# Altium schematic sheet Power.SchDoc
size A3; Organization: Altium Limited; Address1: L3, 12a Rodborough Rd; Address2: Frenchs Forest; Address3: NSW; Address4: Australia 2086
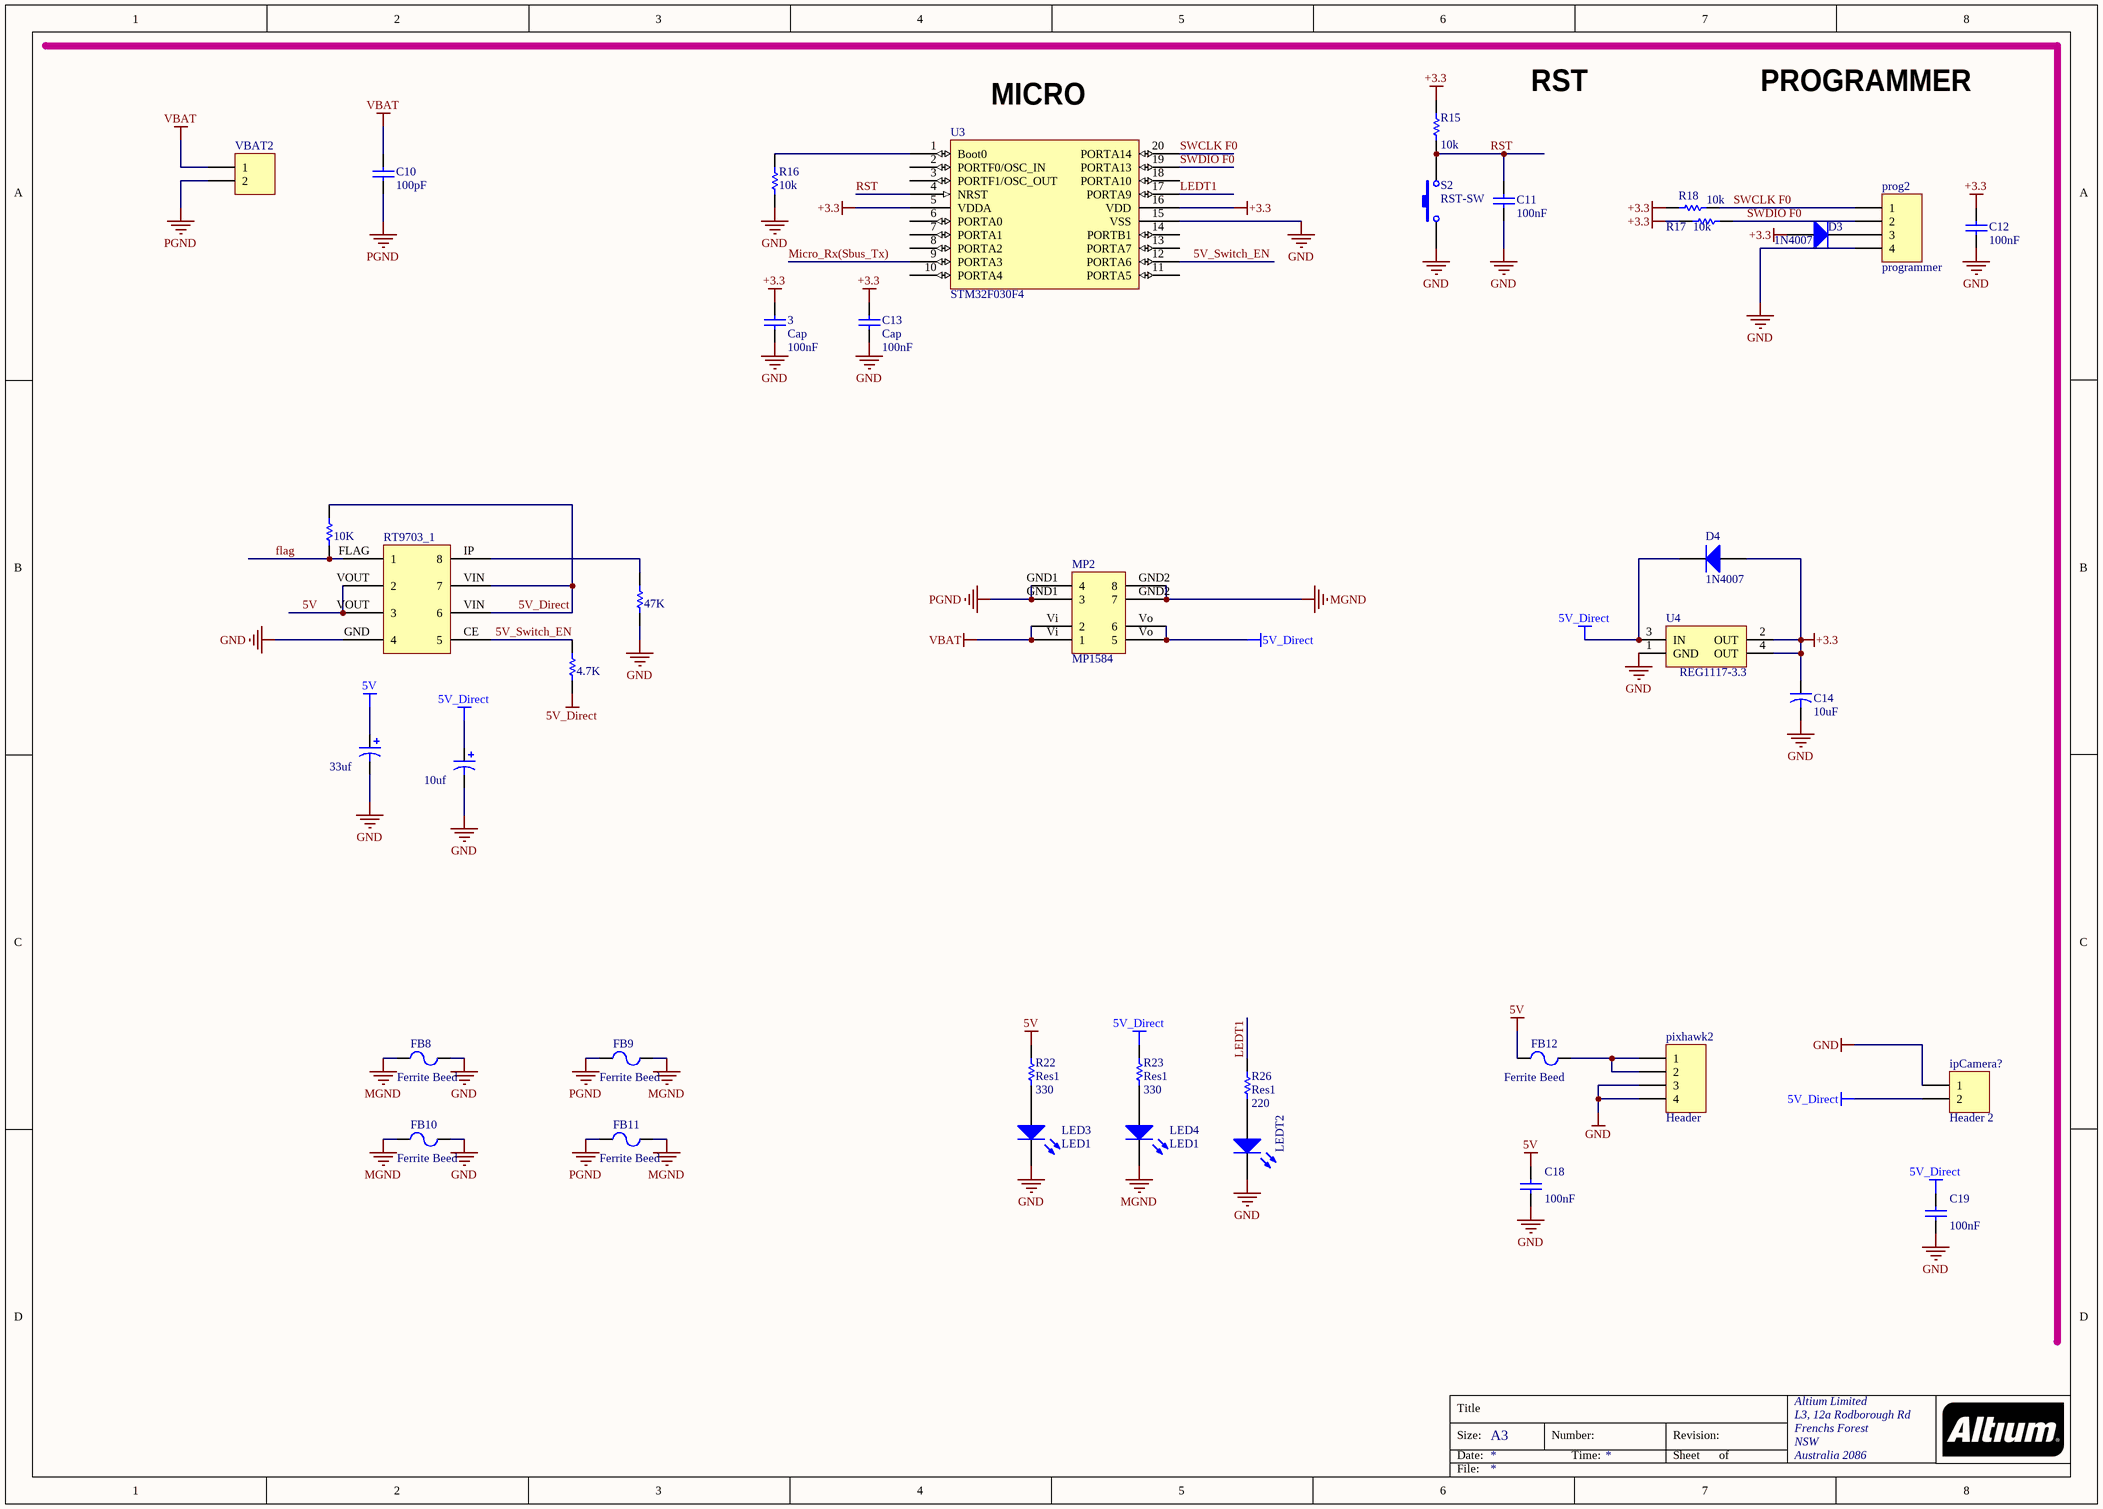
[diagram p0: Power.SchDoc]

## Parts
3  Cap  value 100nF  [j1-0603]
C10  value 100pF  [Deep Cap gerdaloo]  (hidden comment: Cap_UP)
C11  value 100nF  [j1-0603]
C12  value 100nF  [j1-0603]
C13  Cap  value 100nF  [j1-0603]
C14  value 10uF  [J1-0603]  (hidden comment: Cap_El)
C15  value 33uf  [J1-0603]  (hidden comment: Cap Pol1)
C16  value 10uf  [J1-0603]  (hidden comment: Cap Pol1)
C18  value 100nF  [j1-0603]
C19  value 100nF  [j1-0603]
D3  1N4007  [US1M]
D4  1N4007  [US1M]
FB8  Ferrite Beed  [deepFB]
FB9  Ferrite Beed  [deepFB]
FB10  Ferrite Beed  [deepFB]
FB11  Ferrite Beed  [deepFB]
FB12  Ferrite Beed  [6-0805_L]
ipCamera?  Header 2  [HDR1X2]
LED3  LED1  [3518]
LED4  LED1  [3518]
LEDT2  (no value)  [3518]
MP2  MP1584  [MP1584]
pixhawk2  Header  [SHeader 4]
prog2  programmer  [SHeader 4]
R15  value 10k  [J1-0603]
R16  10k  [j1-0603]
R17  value 10k  [J1-0603]
R18  value 10k  [J1-0603]
R19  value 10K  [j1-0603]  (hidden comment: Res1)
R20  value 47K  [j1-0603]  (hidden comment: Res1)
R21  value 4.7K  [j1-0603]  (hidden comment: Res1)
R22  Res1  value 330  [j1-0603]
R23  Res1  value 330  [j1-0603]
R26  Res1  value 220  [j1-0603]
RT9703_1  RT9703( 3A power switch)  [RT9703]  (value not drawn)
S2  RST-SW  [SW-PB-4P]
U3  STM32F030F4  [STM-TSSOP20_L]
U4  REG1117-3.3  [SOT223]
VBAT2  Header 2  [xt-30]  (value not drawn)

## Nets
5V: C15.1 C18.2 FB12.1 R22.1 RT9703_1.VOUT(2)
5V_Direct: C16.1 C19.2 D4.2(K) ipCamera?.2 MP2.Vo(5) R19.1 R21.2 R23.1 RT9703_1.VIN(7) U4.3(IN)
+3.3: 3.2 C12.2 C13.2 C14.1 D3.1(A) D4.1(A) R15.1 R17.1 R18.1 U3.5(VDDA) U3.16(VDD) U4.2(OUT) U4.4(OUT)
GND: 3.1 C11.1 C12.1 C13.1 C14.2 C15.2 C16.2 C18.1 C19.1 FB8.2 FB10.2 ipCamera?.1 LED3.2(K) LEDT2.2(K) pixhawk2.3 pixhawk2.4 prog2.4 R16.1 R20.1 RT9703_1.GND(4) S2.1 U3.15(VSS) U4.1(GND)
MGND: FB8.1 FB9.2 FB10.1 FB11.2 LED4.2(K) MP2.GND2(8)
PGND: C10.1 FB9.1 FB11.1 MP2.GND1(4) VBAT2.-(2)
VBAT: C10.2 MP2.Vi(1) VBAT2.+(1)
5V_Switch_EN: R21.1 RT9703_1.CE(5) U3.12(PORTA6)
flag: R19.2 RT9703_1.FLAG(1)
LEDT1: R26.1 U3.17(PORTA9)
Micro_Rx(Sbus_Tx): U3.9(PORTA3)
RST: C11.2 R15.2 S2.2 U3.4(NRST)
SWCLK F0: prog2.1 R18.2 U3.20(PORTA14)
SWDIO F0: prog2.2 R17.2 U3.19(PORTA13)
NetD3_2: D3.2(K) prog2.3
NetFB12_2: FB12.2 pixhawk2.1 pixhawk2.2
NetLED3_1: LED3.1(A) R22.2
NetLED4_1: LED4.1(A) R23.2
NetLEDT2_1: LEDT2.1(A) R26.2
NetR16_2: R16.2 U3.1(Boot0)
NetR20_2: R20.2 RT9703_1.IP(8)

Not connected (* = marked no-connect by the designer): U3 2(PORTF0/OSC_IN) 3(PORTF1/OSC_OUT) 6(PORTA0) 7(PORTA1) 8(PORTA2) 10(PORTA4) 11(PORTA5) 13(PORTA7) 14(PORTB1) 18(PORTA10)

## Notes on the sheet
- (near U3) MICRO
- RST
- PROGRAMMER
- Title
- Size:
- Date:
- A3
- Number:
- Time:
- Revision:
- Sheet
- of
- File:

## Library data of the parts
3 C13 = Cap: Capacitor; Published: 8-Jun-2000; LatestRevisionDate: 17-Jul-2002; LatestRevisionNote: Re-released for DXP Platform.; PackageReference: RAD-0.3; Publisher: Altium Limited
C10 = Cap_UP: Capacitor; Published: 8-Jun-2000; LatestRevisionDate: 17-Jul-2002; LatestRevisionNote: Re-released for DXP Platform.; PackageReference: RAD-0.3; Publisher: Altium Limited
C11 C12 C18 C19 = Cap: Capacitor; Manufacturer: Generic Components; Class: Passive; Published: 08/06/2000; Publisher: Altium Hobart Technology Centre; SubClass: Capacitor
C14 = Cap_El: Capacitor; Published: 23-Sep-2002; PackageReference: CAPR5-4X5; Publisher: Altium Limited
C15 C16 = Cap Pol1: Polarized Capacitor (Radial); Published: 8-Jun-2000; LatestRevisionDate: 17-Jul-2002; LatestRevisionNote: Re-released for DXP Platform.; PackageReference: RB7.6-15; Publisher: Altium Limited
D3 D4 = Diode: 1 Amp General Purpose Rectifier; Revision 1: 11-Jul-2000: SIM Model Added.; Revision 2: 17-Jul-2002: Re-released for DXP Platform.; Package Information: Latest Revision: Aug-1999; Code - JEDEC: DO-204-AL; Published: 8-Jun-2000; Datasheet: Latest Revision: 1998; Package Reference: DO-41; Publisher: Altium Limited
FB8-FB12 = Ferrite Beed: Code_IEC: 1005; Published: 8-Jun-2000; LatestRevisionDate: 17-Jul-2002; LatestRevisionNote: Re-released for DXP Platform.; PackageReference: 0402-A; Publisher: Altium Limited; Code_JEITA: 0402
ipCamera? VBAT2 = Header 2: Header, 2-Pin; Publisher: Altium Limited
  ipCamera?: LatestRevisionDate: 17-Jul-2002; LatestRevisionNote: Re-released for DXP Platform.
  VBAT2: Revision: 17-Jul-2002: Re-released for DXP Platform.
LED3 LED4 LEDT2 = LED3: Typical BLUE SiC LED; pin to pad: 1>2 2>1; Published: 8-Jun-2000; LatestRevisionDate: 17-Dec-2003; LatestRevisionNote: PCB Footprint replaced.; DatasheetDocument: 16-Apr-2002; PackageDocument: 16-Apr-2002; PackageReference: 3.5X2.8X1.9; Publisher: Altium Limited
pixhawk2 prog2 = Header 4: Header, 4-Pin; LatestRevisionDate: 17-Jul-2002; LatestRevisionNote: Re-released for DXP Platform.; Publisher: Altium Limited
R15 R17 R18 = Res: Semiconductor Resistor; Published: 8-Jun-2000; LatestRevisionDate: 17-Jul-2002; LatestRevisionNote: Re-released for DXP Platform.; PackageReference: AXIAL-0.5; Publisher: Altium Limited
R16 = Res1: Resistor; Value: 1K; Published: 8-Jun-2000; LatestRevisionDate: 17-Jul-2002; LatestRevisionNote: Re-released for DXP Platform.; PackageReference: AXIAL-0.3; Publisher: Altium Limited
R19-R23 R26 = Res1: Resistor; Published: 8-Jun-2000; LatestRevisionDate: 17-Jul-2002; LatestRevisionNote: Re-released for DXP Platform.; PackageReference: AXIAL-0.3; Publisher: Altium Limited
S2 = SW-PB: Switch; Published: 24-Mar-1999; LatestRevisionDate: 17-Jul-2002; LatestRevisionNote: Re-released for DXP Platform.; PackageReference: SPST-2; Publisher: Altium Limited
U3 = STM32F030F4: STM 32Bits Microcontroller
U4 = REG1117-3.3: 800mA and 1A Low Dropout Positive Regulator 2.85V, 3.3V, 5V, and Adjustable; Published: 8-Jun-2000; LatestRevisionDate: 17-Jul-2002; LatestRevisionNote: Re-released for DXP Platform.; DatasheetVersion: Sep-1997; PackageVersion: revC; PackageReference: ZZ311; Publisher: Altium Limited; PackageDescription: SOT-223/SC-73; 4 Leads; Body 6.7 x 7.3 mm, inc. leads (LxW max); ComponentLink1Description: Manufacturer Link; ComponentLink1URL: http://www.ti.com/; ComponentLink2Description: Datasheet; ComponentLink2URL: http://www-s.ti.com/sc/ds/REG1117.pdf